# EAGLE design McPiFace-60mmFan-V4.0 (EAGLE 7.4.0)
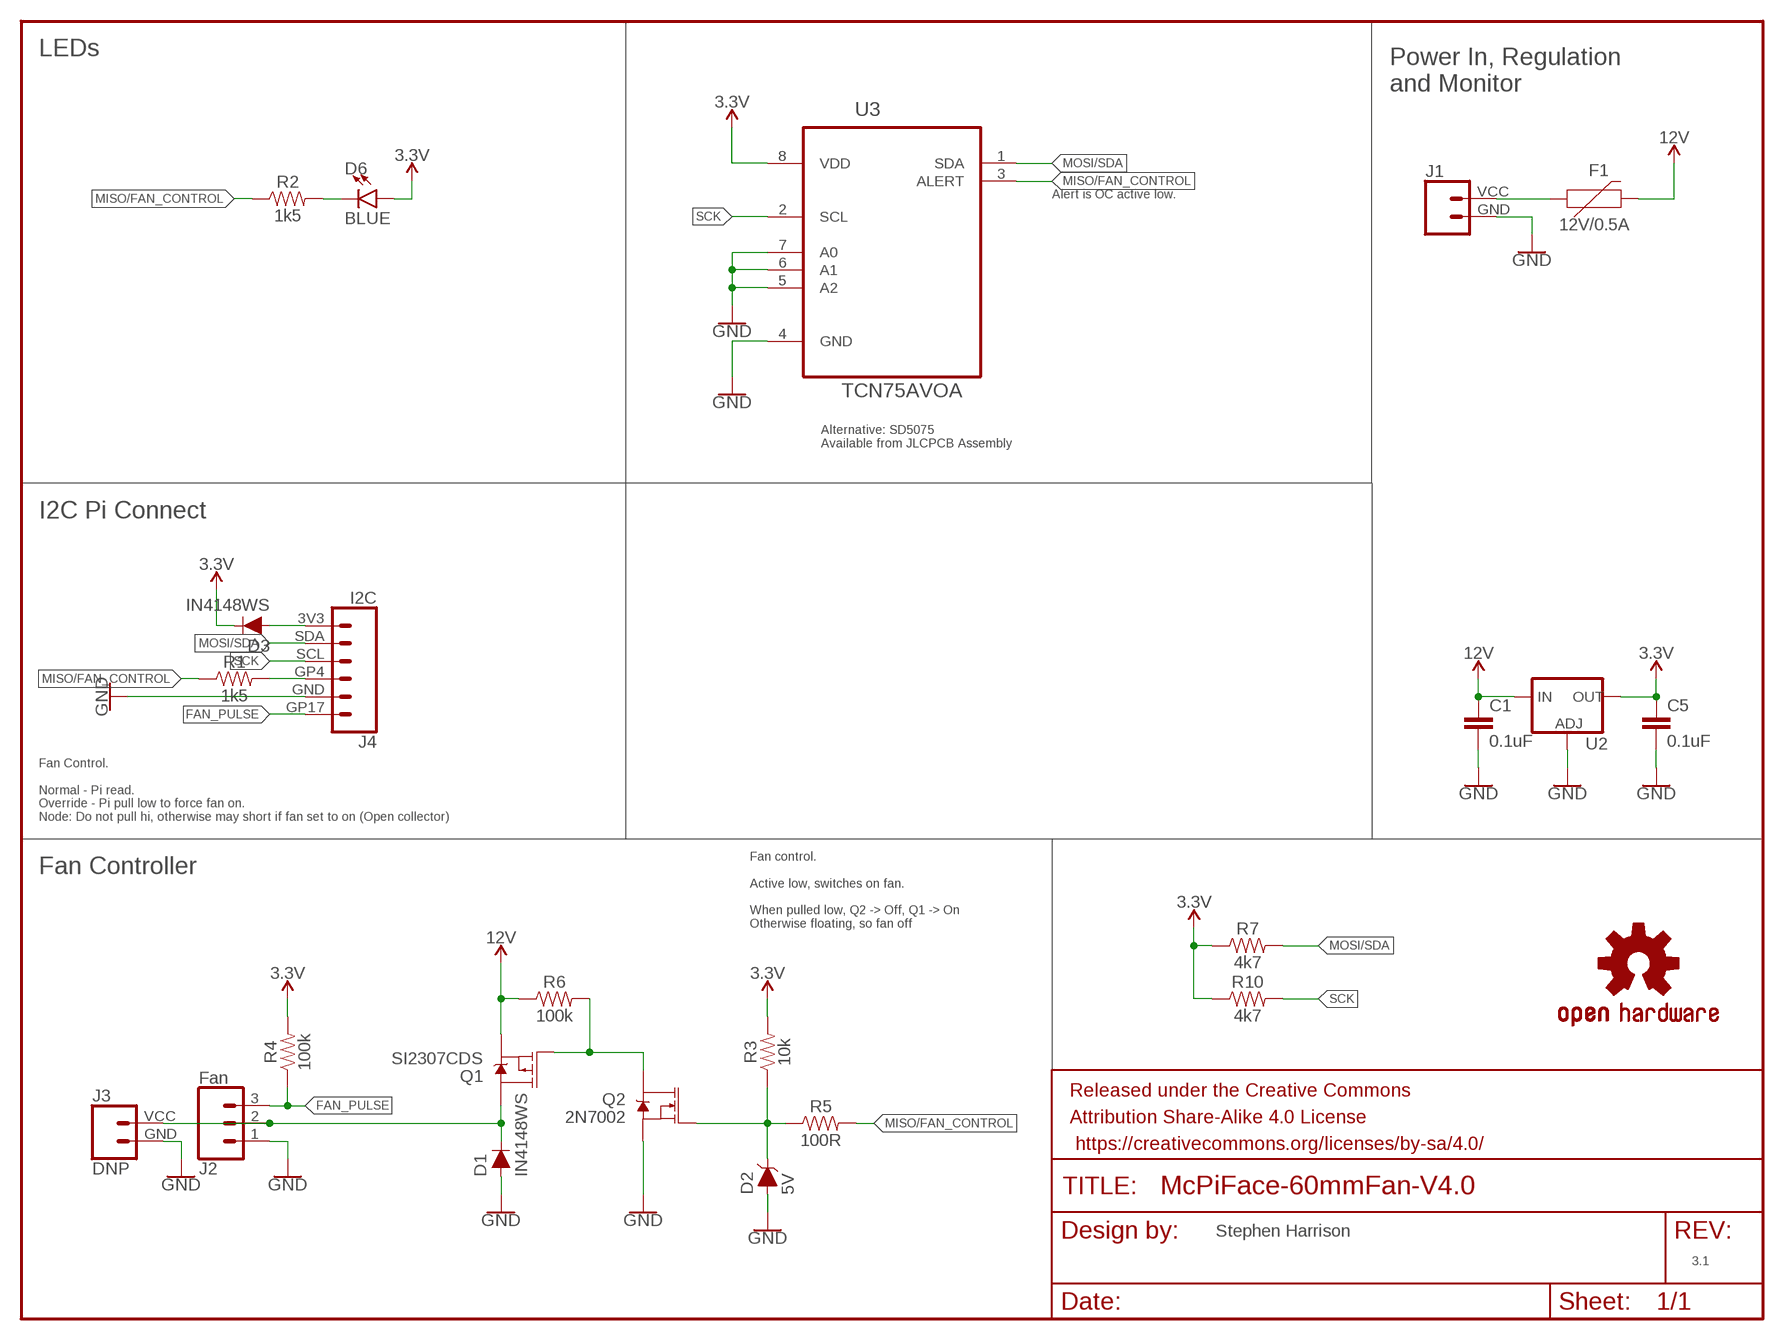
[diagram p0: schematic, sheet 1]

## Parts
C1  0.1uF  0.1UF-0805-25V  [0805]
C5  0.1uF  0.1UF-0805-25V  [0805]
D1  IN4148WS  DIODE-BAS16J  [SOD-323]
D2  5V  DIODE-ZENER-BZT52C3V6S  [SOD-323]
D3  IN4148WS  DIODE-BAS16J  [SOD-323]
D6  BLUE  LED1206  [LED-1206]
F1  12V/0.5A  PPTC_HALF-AMP  [1206]
FRAME1  FRAME-LETTER  [CREATIVE_COMMONS]
J1  CONN_024UCON-15767  [JST-2-SMD-VERT]
J2  Fan  CONN_03JST-SMD  [JST-3-SMD]
J3  DNP  CONN_024UCON-15767  [JST-2-SMD-VERT]
J4  I2C  MC_PI_FACE_I2CTOP  [JST-6-SH-1.0MM-TOP]
LOGO1  OSHW-LOGOL  [OSHW-LOGO-L]
Q1  SI2307CDS  MOSFET_PCH-IRLML2244  [SOT23-3]
Q2  2N7002  MOSFET-NCH-BSS138  [SOT23-3]
R1  1k5  RESISTOR0805  [0805]
R2  1k5  RESISTOR0805  [0805]
R3  10k  RESISTOR0805  [0805]
R4  100k  RESISTOR0805  [0805]
R5  100R  RESISTOR0805  [0805]
R6  100k  RESISTOR0805  [0805]
R7  4k7  RESISTOR0805  [0805]
R10  4k7  RESISTOR0805  [0805]
U2  V_REG_LM1117SOT223  [SOT223]
U3  TCN75AVOA  [SOIC127P600X175-8N]

## Nets
3.3V: C5.1 D3.C D6.A R3.2 R4.2 R7.1 R10.1 U2.2(OUT) U2.4(OUT) U3.8(VDD)
12V: C1.1 F1.2 Q1.2(S) R6.1 U2.3(IN)
FAN_PULSE: J2.3 J4.GP17 R4.1
GND: C1.2 C5.2 D1.A D2.A J1.GND J2.1 J3.GND J4.GND Q2.2(S) U2.1(ADJ) U3.4(GND) U3.5(A2) U3.6(A1) U3.7(A0)
MISO/FAN_CONTROL: R1.1 R2.1 R5.2 U3.3(ALERT)
MOSI/SDA: J4.SDA R7.2 U3.1(SDA)
N$1: D6.C R2.2
N$2: J4.GP4 R1.2
N$3: D3.A J4.3V3
N$6: F1.1 J1.VCC
N$8: D1.C J2.2 J3.VCC Q1.3(D)
N$10: Q1.1(G) Q2.3(D) R6.2
N$11: D2.C Q2.1(G) R3.1 R5.1
SCK: J4.SCL R10.2 U3.2(SCL)

## Notes on the sheet
- LEDs
- Power In, Regulation 
  and Monitor
- Alert is OC active low.
- Alternative: SD5075 
  Available from JLCPCB Assembly
- I2C Pi Connect
- Fan Control.
  
  Normal - Pi read.
  Override - Pi pull low to force fan on.
  Node: Do not pull hi, otherwise may short if fan set to on (Open collector)
- Fan Controller
- Fan control.
  
  Active low, switches on fan.
  
  When pulled low, Q2 -> Off, Q1 -> On
  Otherwise floating, so fan off
- Stephen Harrison
- 3.1

## Library data of the parts
C1 C5 = ThingySticks:0.1UF: 0.1µF ceramic capacitors A capacitor is a passive two-terminal electrical component used to store electrical energy temporarily in an electric field.
D1 D3 = SparkFun-DiscreteSemi:DIODE: Diode These are standard reverse protection diodes and small signal diodes. SparkFun Products: SparkFun SparkPunk Sound Kit <https://www.sparkfun.com/products/11177> SparkFun ESP8266 Thing <https://www.sparkfun.com/products/13231>; LCSC: C2128; PROD_ID: DIO-09646; VALUE: 250mA/100V
D2 = SparkFun-DiscreteSemi:DIODE-ZENER: Zener Diode A Zener diode allows current to flow from its anode to its cathode like a normal semiconductor diode, but it also permits current to flow in the reverse direction when its "Zener voltage" is reached. - WIkipedia; PROD_ID: DIO-08199; VALUE: 3.6V
D6 = ThingySticks:LED: LED (Generic) Standard schematic elements and footprints for 5mm, 3mm, 1206, and 0603 sized LEDs. Generic LEDs with no color specified.
F1 = SparkFun-Fuses:PPTC: Resettable Fuse PPTC Resettable Fuse. Really a sort of resistor with a polymeric positive temperature coefficient whose resistance increases dramatically with an increase in temperature. When heated by the power passing through the resistance rises causing the current to be limited, protecting the circuit. This is achieved by the transition of the polymer from a crystalline to an amorphous state where the conductive carbon separates breaking the conductive pathways found in the cool crystalline structure. When a PPTC cools back down it resumes conducting letting the circuit turn back on. SparkFun Products: SparkFun RedBoard - Programmed with Arduino <https://www.sparkfun.com/products/12757> Pro Micro - 5V/16MHz <https://www.sparkfun.com/products/12640> Arduino Pro 328 - 5V/16MHz <https://www.sparkfun.com/products/10915> MP3 Trigger <https://www.sparkfun.com/products/13720>; PROD_ID: RES-08585; VALUE: 6V/0.5A
FRAME1 = SparkFun-Aesthetics:FRAME-LETTER: Schematic Frame - Letter Standard 8.5x11 US Letter frame
J1 J3 = SparkFun-Connectors:CONN_02: Multi connection point. Often used as Generic Header-pin footprint for 0.1 inch spaced/style header connections On any of the 0.1 inch spaced packages, you can populate with these: Break Away Headers - Straight <https://www.sparkfun.com/products/116> (PRT-00116) Break Away Male Headers - Right Angle <https://www.sparkfun.com/products/553> (PRT-00553) Female Headers <https://www.sparkfun.com/products/115> (PRT-00115) Break Away Headers - Machine Pin <https://www.sparkfun.com/products/117> (PRT-00117) Break Away Female Headers - Swiss Machine Pin <https://www.sparkfun.com/products/743> (PRT-00743) For SCREWTERMINALS and SPRING TERMINALS visit here: Screw Terimnals on SparkFun.com <https://www.sparkfun.com/search/results?term=Screw+Terminals> (5mm/3.5mm/2.54mm spacing) This device is also useful as a general connection point to wire up your design to another part of your project. Our various solder wires solder well into these plated through hole pads. Hook-Up Wire - Assortment (Stranded, 22 AWG) <https://www.sparkfun.com/products/11375> (PRT-11375) Hook-Up Wire - Assortment (Solid Core, 22 AWG) <https://www.sparkfun.com/products/11367> (PRT-11367) View the entire wire category on our website here <https://www.sparkfun.com/categories/141> Special notes: Molex polarized connector foot print use with: PRT-08233 with associated crimp pins and housings. 2.54_SCREWTERM for use with PRT-10571. 3.5mm Screw Terminal footprints for PRT-08084 5mm Screw Terminal footprints for use with PRT-08432
J2 = SparkFun-Connectors:CONN_03: Multi connection point. Often used as Generic Header-pin footprint for 0.1 inch spaced/style header connections On any of the 0.1 inch spaced packages, you can populate with these: Break Away Headers - Straight <https://www.sparkfun.com/products/116> (PRT-00116) Break Away Male Headers - Right Angle <https://www.sparkfun.com/products/553> (PRT-00553) Female Headers <https://www.sparkfun.com/products/115> (PRT-00115) Break Away Headers - Machine Pin <https://www.sparkfun.com/products/117> (PRT-00117) Break Away Female Headers - Swiss Machine Pin <https://www.sparkfun.com/products/743> (PRT-00743) Stackable Header - 3 Pin (Female, 0.1") <https://www.sparkfun.com/products/13875> (PRT-13875) For SCREWTERMINALS and SPRING TERMINALS visit here: Screw Terimnals on SparkFun.com <https://www.sparkfun.com/search/results?term=Screw+Terminals> (5mm/3.5mm/2.54mm spacing) This device is also useful as a general connection point to wire up your design to another part of your project. Our various solder wires solder well into these plated through hole pads. Hook-Up Wire - Assortment (Stranded, 22 AWG) <https://www.sparkfun.com/products/11375> (PRT-11375) Hook-Up Wire - Assortment (Solid Core, 22 AWG) <https://www.sparkfun.com/products/11367> (PRT-11367) View the entire wire category on our website here <https://www.sparkfun.com/categories/141> Special notes: Molex polarized connector foot print use with SKU : PRT-08232 with associated crimp pins and housings.; FARNELL: 9492623; MFG: S3B-PH-SM4-TB(LF)(SN); PROD_ID: CONN-12591; VALUE: 3-PIN SMD
J4 = McPiFace:MC_PI_FACE_I2C
LOGO1 = SparkFun-Aesthetics:OSHW-LOGO: Open-Source Hardware (OSHW) Logo This logo indicates the piece of hardware it is found on incorporates a OSHW license and/or adheres to the definition of open source hardware found here: http://freedomdefined.org/OSHW
Q1 = SparkFun-DiscreteSemi:MOSFET_PCH: P-channel MOSFETs Voltage controlled devices that allow control of high current outputs. SparkFun Products: SparkFun ESP32 Thing <https://www.sparkfun.com/products/13907> SparkFun ESP8266 Thing <https://www.sparkfun.com/products/13231>; FARNELL: 1779262; LCSC: C189813; PROD_ID: TRANS-11153; VALUE: 4.3A/20V/54mΩ
Q2 = SparkFun-DiscreteSemi:MOSFET-NCH: N-channel MOSFETs Voltage controlled devices that allow control of high current outputs. SparkFun Products: SparkFun OpenScale <https://www.sparkfun.com/products/13261> SparkFun Digital Sandbox <https://www.sparkfun.com/products/12651> SparkFun Monster Moto Shield <https://www.sparkfun.com/products/10182> SparkFun MOSFET Power Controller <https://www.sparkfun.com/products/11214>; FARNELL: 1510761; PROD_ID: TRANS-00830; VALUE: 220mA/50V/3.5Ω
R1-R7 R10 = SparkFun-Resistors:RESISTOR: Generic Resistor Package
U2 = SparkFun-IC-Power:V_REG_LM1117: Voltage Regulator LM1117 Standard adjustable voltage regulator but in SMD form. Spark Fun Electronics SKU : COM-00595; LCSC: C126027; PROD_ID: VREG-08170
U3 = Microchip-TCN75AVOA:TCN75AVOA: 2-Wire Serial Temperature Sensor,SOIC-8; MPN: TCN75AVOA; OC_FARNELL: 1605585; OC_NEWARK: 71J7900; PACKAGE: SOIC-8; SUPPLIER: MICROCHIP

## Board
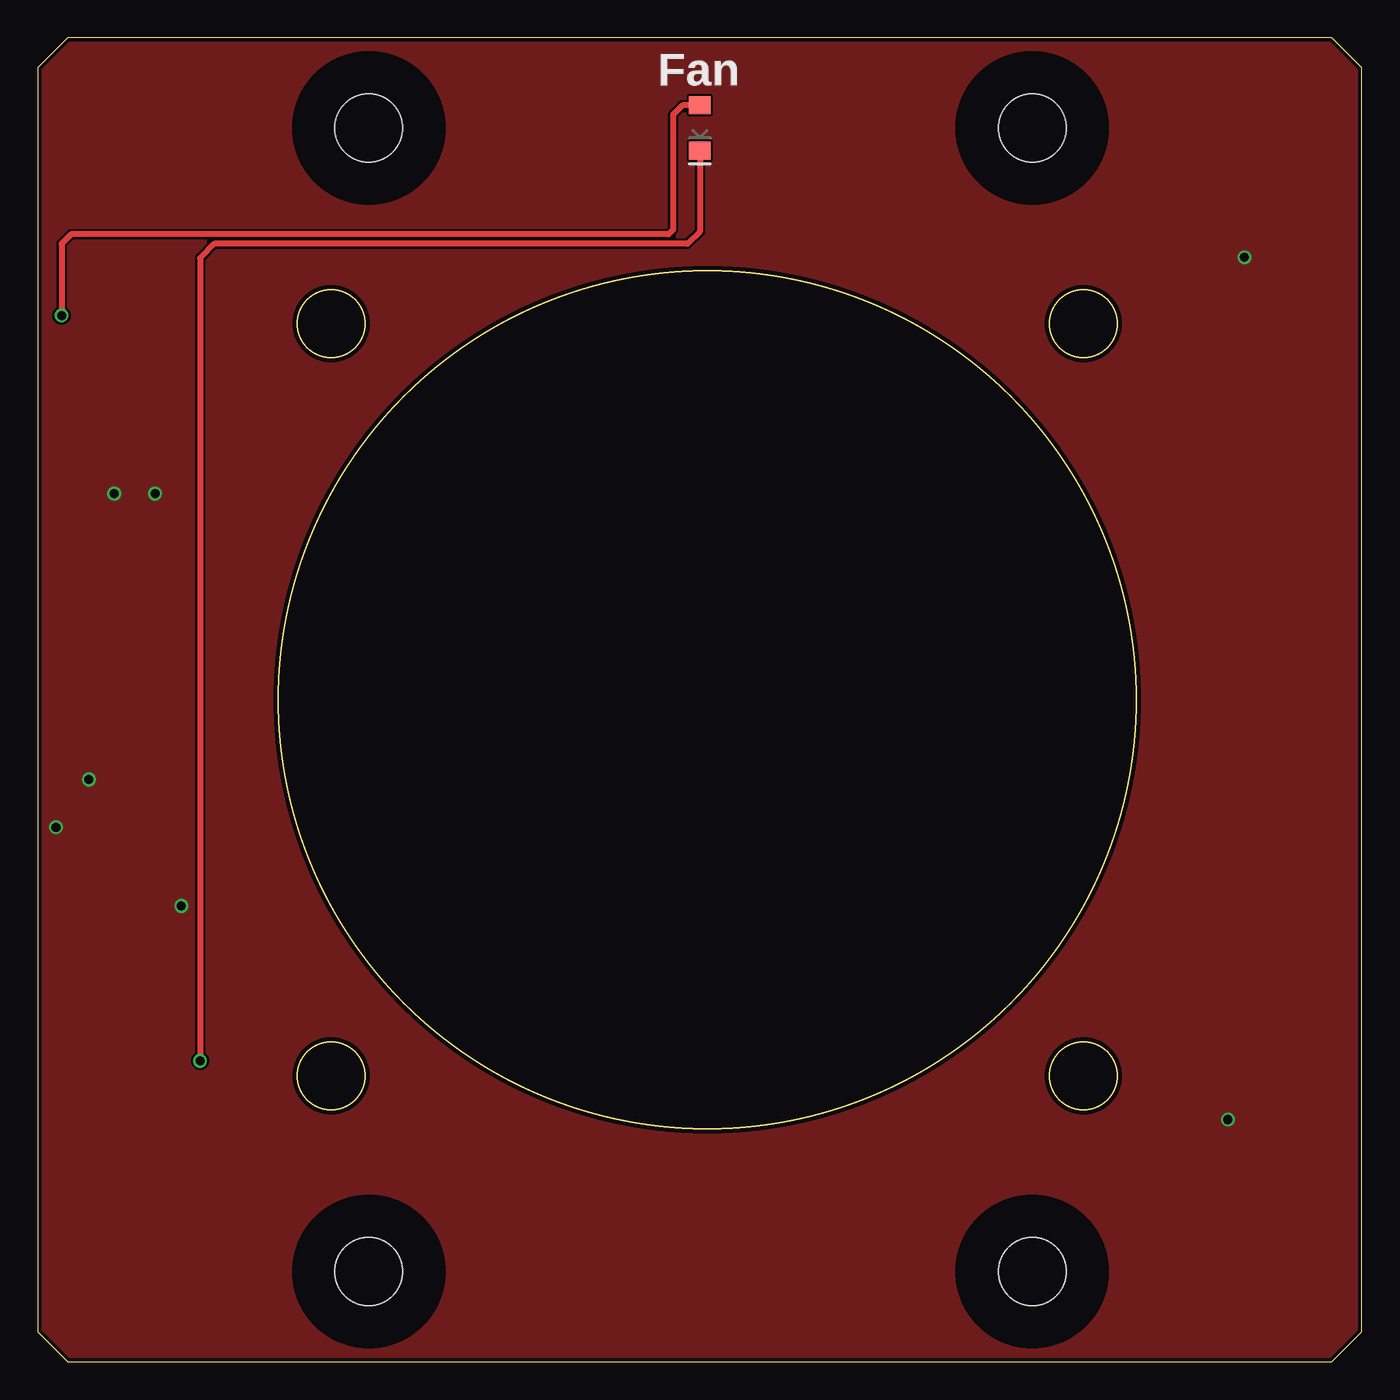
[diagram p1: board, top side]
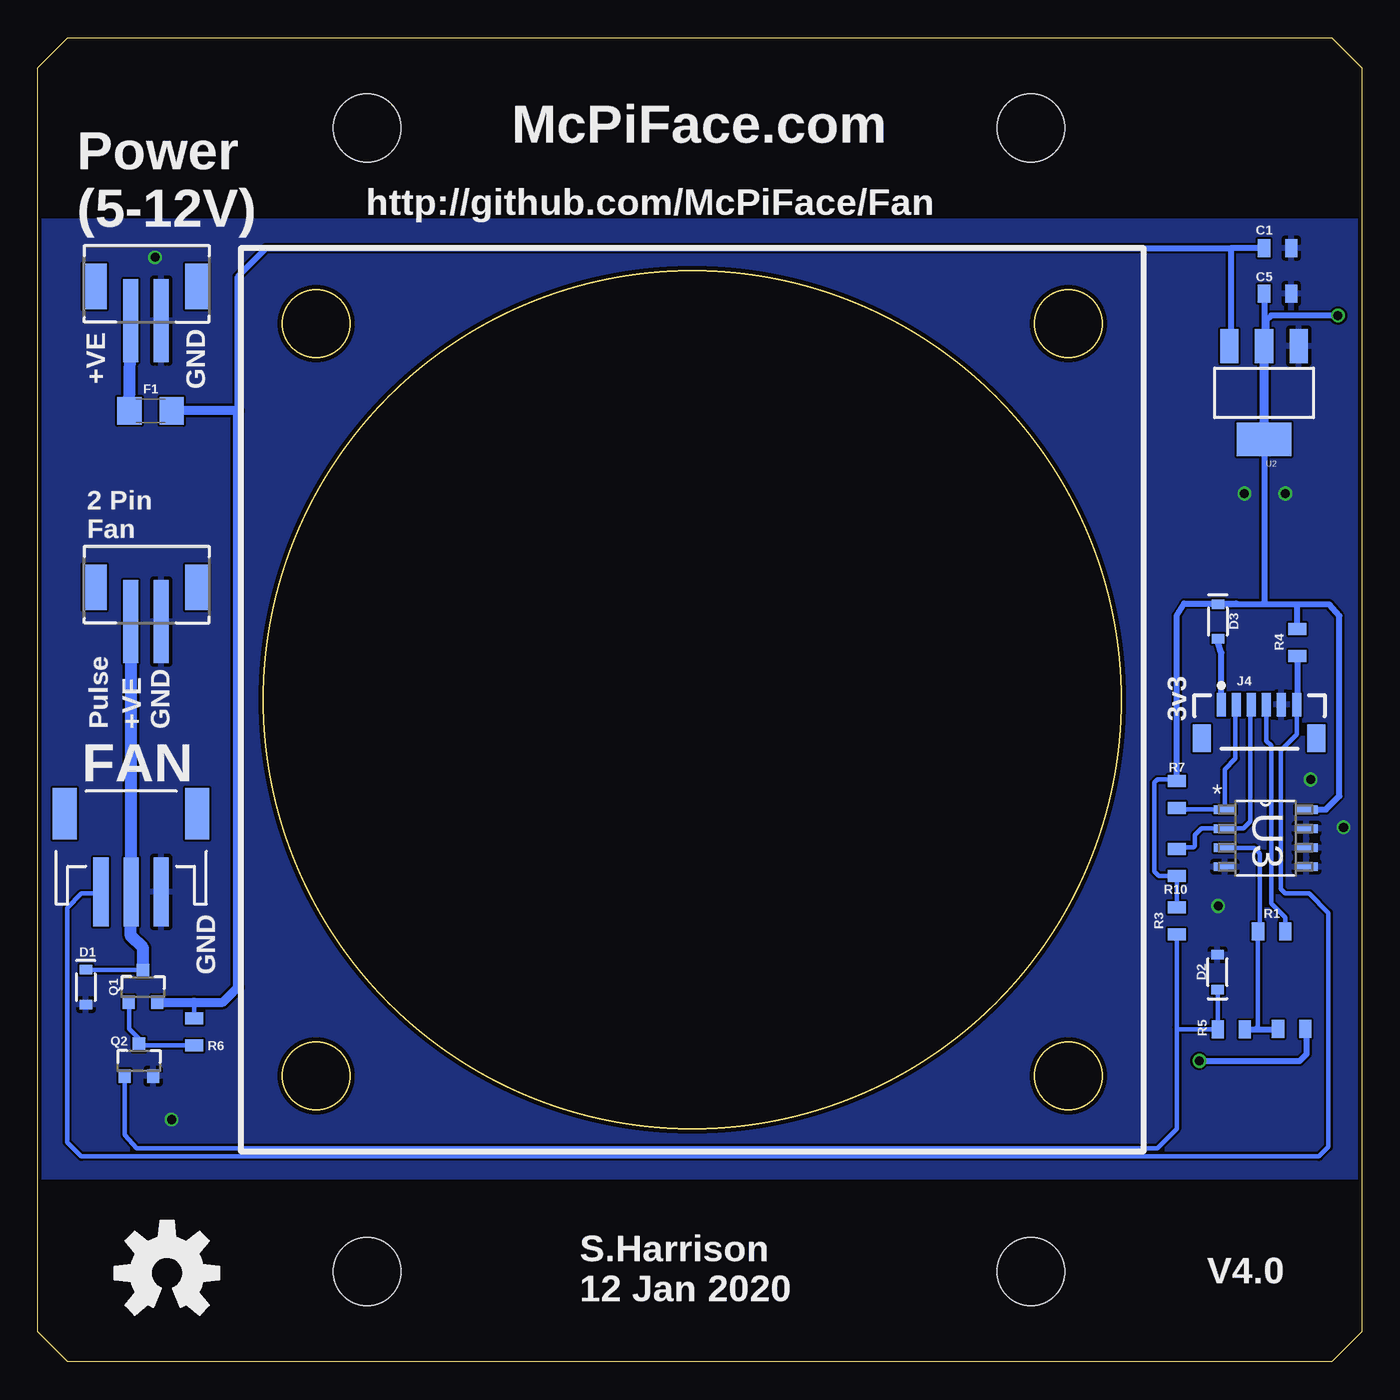
[diagram p2: board, bottom side, seen from below]

Size 88 x 88 mm. Coordinates in mm from the lower left corner, seen from the top.
Outline: 2,0 86,0 88,2 88,86 86,88 2,88 0,86 0,2 2,0
Outline: circle at 44.5,44 radius 28.5
Outline: circle at 19.5,69 radius 2.25
Outline: circle at 69.5,69 radius 2.25
Outline: circle at 69.5,19 radius 2.25
Outline: circle at 19.5,19 radius 2.25
Copper layers (1*16): Top 0.035mm / dielectric 1.5mm / Bottom 0.035mm
Design rules "dirt_cheap_dirty_boards.v1.1": minimum track width 6mil, minimum drill 12mil, track to track 6mil, track to pad 6mil, pad to pad 6mil, via to via 6mil, smd to smd 0mil, copper to edge 10mil, drill to drill 10mil, minimum pad ring 10mil, minimum via ring 6mil, stop-mask expansion 2mil, vias tented up to drill 25mil, thermal gap 10mil
Holes 4.5 mm at 22,6 22,82 66.1,82 66.1,6
bKeepout: area 0,76 to 88,88; area 0,0 to 88,12.1
tRestrict: area 17,77 to 27,87; area 17,1 to 27,11; area 61.1,1 to 71.1,11; area 61.1,77 to 71.1,87
bRestrict: area 0,76 to 88,88; area 0,0 to 88,12.1

### Footprints (pad centres in the part's own frame; a part is rotated, then mirrored left to right if it is on the bottom)
0805 = smd 0.8 x 1.2: 1 -0.9,0; 2 0.9,0
SOD-323 = smd 0.63 x 0.83: A 1.15,0; C -1.15,0
LED-1206 = smd 1.2 x 1.4: A -1.5,0; C 1.5,0
1206 = smd 1.6 x 1.8: 1 -1.4,0; 2 1.4,0
JST-2-SMD-VERT = smd 1 x 5.5: GND 1,-2; VCC -1,-2 | smd 1.6 x 3: P$1 -3.4,0.27; P$2 3.4,0.27
JST-3-SMD = smd 1 x 4.6: 1 2.01,-4.77; 2 0.01,-4.77; 3 -1.99,-4.77 | smd 1.6 x 3.4: NC1 -4.39,0.43; NC2 4.41,0.43
JST-6-SH-1.0MM-TOP = smd 0.6 x 1.55: 3V3 -2.54,1.27; GND 1.46,1.27; GP4 0.46,1.27; GP17 2.46,1.27; SCL -0.54,1.27; SDA -1.54,1.27 | smd 1.2 x 1.8: P$1 -3.84,-0.955; P$2 3.76,-0.955
SOT23-3 = smd 0.8 x 0.9: 1 -0.95,-1; 2 0.95,-1; 3 0,1.1
SOT223 = smd 1.219 x 2.235: 1 -2.311,-3.099; 2 0,-3.099; 3 2.311,-3.099 | smd 3.6 x 2.2: 4 0,3.099
SOIC127P600X175-8N = smd 1.473 x 0.559: 1 -2.718,1.905; 2 -2.718,0.635; 3 -2.718,-0.635; 4 -2.718,-1.905; 5 2.718,-1.905; 6 2.718,-0.635; 7 2.718,0.635; 8 2.718,1.905

### Placement (x,y rotation side)
C1  5.6,74 0 bottom
C5  5.6,71 0 bottom
D1  84.8,24.9 270 bottom
D2  9.6,25.9 90 bottom
D3  9.57,49.2 270 bottom
D6  44,82 270 top
F1  80.5,63.2 0 bottom
FRAME1  6.2,-14.8 0 top  (outside the outline)
J1  80.8,71.2 0 bottom
J2  81.8,36 0 bottom
J3  80.8,51.2 0 bottom
J4  6.8,42.4 0 bottom
LOGO1  79.4,5.9 0 bottom
Q1  81,24.9 0 bottom
Q2  81.27,20 0 bottom
R1  6,28.6 0 bottom
R2  4.67,22.12 0 bottom
R3  12.3,29.3 90 bottom
R4  4.3,47.81 90 bottom
R5  8.68,22.11 0 bottom
R6  77.6,21.93 270 bottom
R7  12.3,37.7 270 bottom
R10  12.3,33.2 90 bottom
U2  6.5,64.4 180 bottom
U3  6.4,34.8 0 bottom

### Tracks (layer width: path | path; a pad name or v marks a point on that pad's centre or on a via)
3.3V  (via drill 0.6)
  Top 0.406: D6.A 42.86,83.5 42.23,82.87 42.23,75.25 41.91,74.93 2.22,74.93 1.59,74.3 v1.59,69.53
  Bottom 0.305: R7.1 12.5,38.7 13.6,38.7 13.8,38.5 13.8,32.6 13.5,32.3 R10.1 R3.2
  Bottom 0.406: 6.6,61.3 U2.4 6.5,50.45 6.6,50.35 | U3.8 2.4,36.7 1.5,37.6 1.5,49.56 2.19,50.35 4.45,50.35 | 6.6,50.35 D3.C 8.35,50.4 11.8,50.4 12.3,49.58 R7.1 | 6.6,50.35 4.45,50.35 | v1.59,69.53 6.03,69.53 6.35,69.22 6.35,67.94 | C5.1 6.5,68.09 6.35,67.94 | 6.35,67.94 6.35,67.65 U2.2 | R4.2 4.3,50.2 4.45,50.35
  Bottom 0.61: U2.4 U2.2
12V
  Bottom 0.305: R6.1 77.6,23.9
  Bottom 0.406: 8.9,66.69 U2.3 | 74.7,63.2 74.7,72.1 72.8,74 8.7,74 | 8.7,74 8.7,66.71 | C1.1 8.7,74
  Bottom 0.61: 8.7,66.71 U2.3 | Q1.2 77.6,23.9 75.7,23.9 74.7,24.9 74.7,63.2 F1.2
FAN_PULSE
  Bottom 0.305: 83.69,31.14 J2.3 83.91,31.11 85.09,31.11 86.04,30.16 86.04,14.61 85.09,13.65 2.86,13.65 2.22,14.29 2.22,29.84 3.49,31.11 5.08,31.11 5.4,31.43 5.4,40.64 4.34,41.7 J4.GP17
  Bottom 0.406: 83.96,31.06 J2.3 83.9,31.12 | R4.1 4.3,43.71 J4.GP17
GND  (via drill 0.6)
  other vias: 80.2,73.4 3.4,38.7 9.55,30.3 5.09,57.7 7.8,57.7 79.1,16.1 1.22,35.52
  pour Top: -1,88.5 88.7,88.5 88.7,-1 -1,-1
  pour Bottom: -1,88.5 88.7,88.5 88.7,-1 -1,-1
MISO/FAN_CONTROL
  Bottom 0.305: R5.2 7.1,22.1 6.9,22.3 R1.1 6.8,28.7 6.8,33.8 7.17,34.16 U3.3
  Bottom 0.406: R5.2 5.58,22.11 R2.1
MOSI/SDA
  Bottom 0.305: J4.SDA 8.4,43.61 8.4,40.1 9.12,39.38 U3.1 12.3,36.7 R7.2
N$1  (via drill 0.6)
  Top 0.406: D6.C 44,75.11 43.18,74.3 11.75,74.3 10.79,73.34 v10.79,20
  Bottom 0.406: v10.79,20 4.13,20 3.67,20.46 3.67,22.23 R2.2
N$2
  Bottom 0.305: R1.2 5.1,29.55 6.03,30.48 6.03,40.96 6.35,41.27 6.35,43.34 J4.GP4 6.4,43.61
N$3
  Bottom 0.406: J4.3V3 9.34,47.11 9.57,47.84 D3.A
N$6
  Bottom 0.813: F1.1 J1.VCC
N$8
  Bottom 0.305: D1.C 81.05,26.05 Q1.3
  Bottom 0.813: Q1.3 81,27.5 81.8,28.3 J2.2 J3.VCC
N$10
  Bottom 0.305: Q1.1 81.92,23.86 81.92,22.11 81.27,21.46 Q2.3 81.22,21.05 79.17,21.05 77.99,21.03 R6.2
N$11
  Bottom 0.305: 12.3,22.2 R3.1 12.3,28.5 | 12.3,22.2 12.3,15.5 13.6,14.2 81.4,14.2 82.2,15.1 82.2,18.68 Q2.1 | 9.6,22.12 R5.1 | R5.1 9.58,24.43 D2.C | R5.1 12.2,22.11 12.3,22.2
SCK
  Bottom 0.254: 7.3,43.71 J4.SCL
  Bottom 0.305: J4.SCL 7.4,43.61 7.4,35.9 7.87,35.44 U3.2 10.66,35.44 11.1,35 11.1,34.3 11.2,34.2 12.2,34.2 R10.2

### Text on the board
tNames: Fan
bNames: McPiFace.com | http://github.com/McPiFace/Fan | Power / (5-12V) | GND | +VE | 2 Pin / Fan | 3v3 | GND | +VE | Pulse | FAN | GND | V4.0 | S.Harrison / 12 Jan 2020